# EAGLE design SparkX_smol_Display (EAGLE 9.6.2)
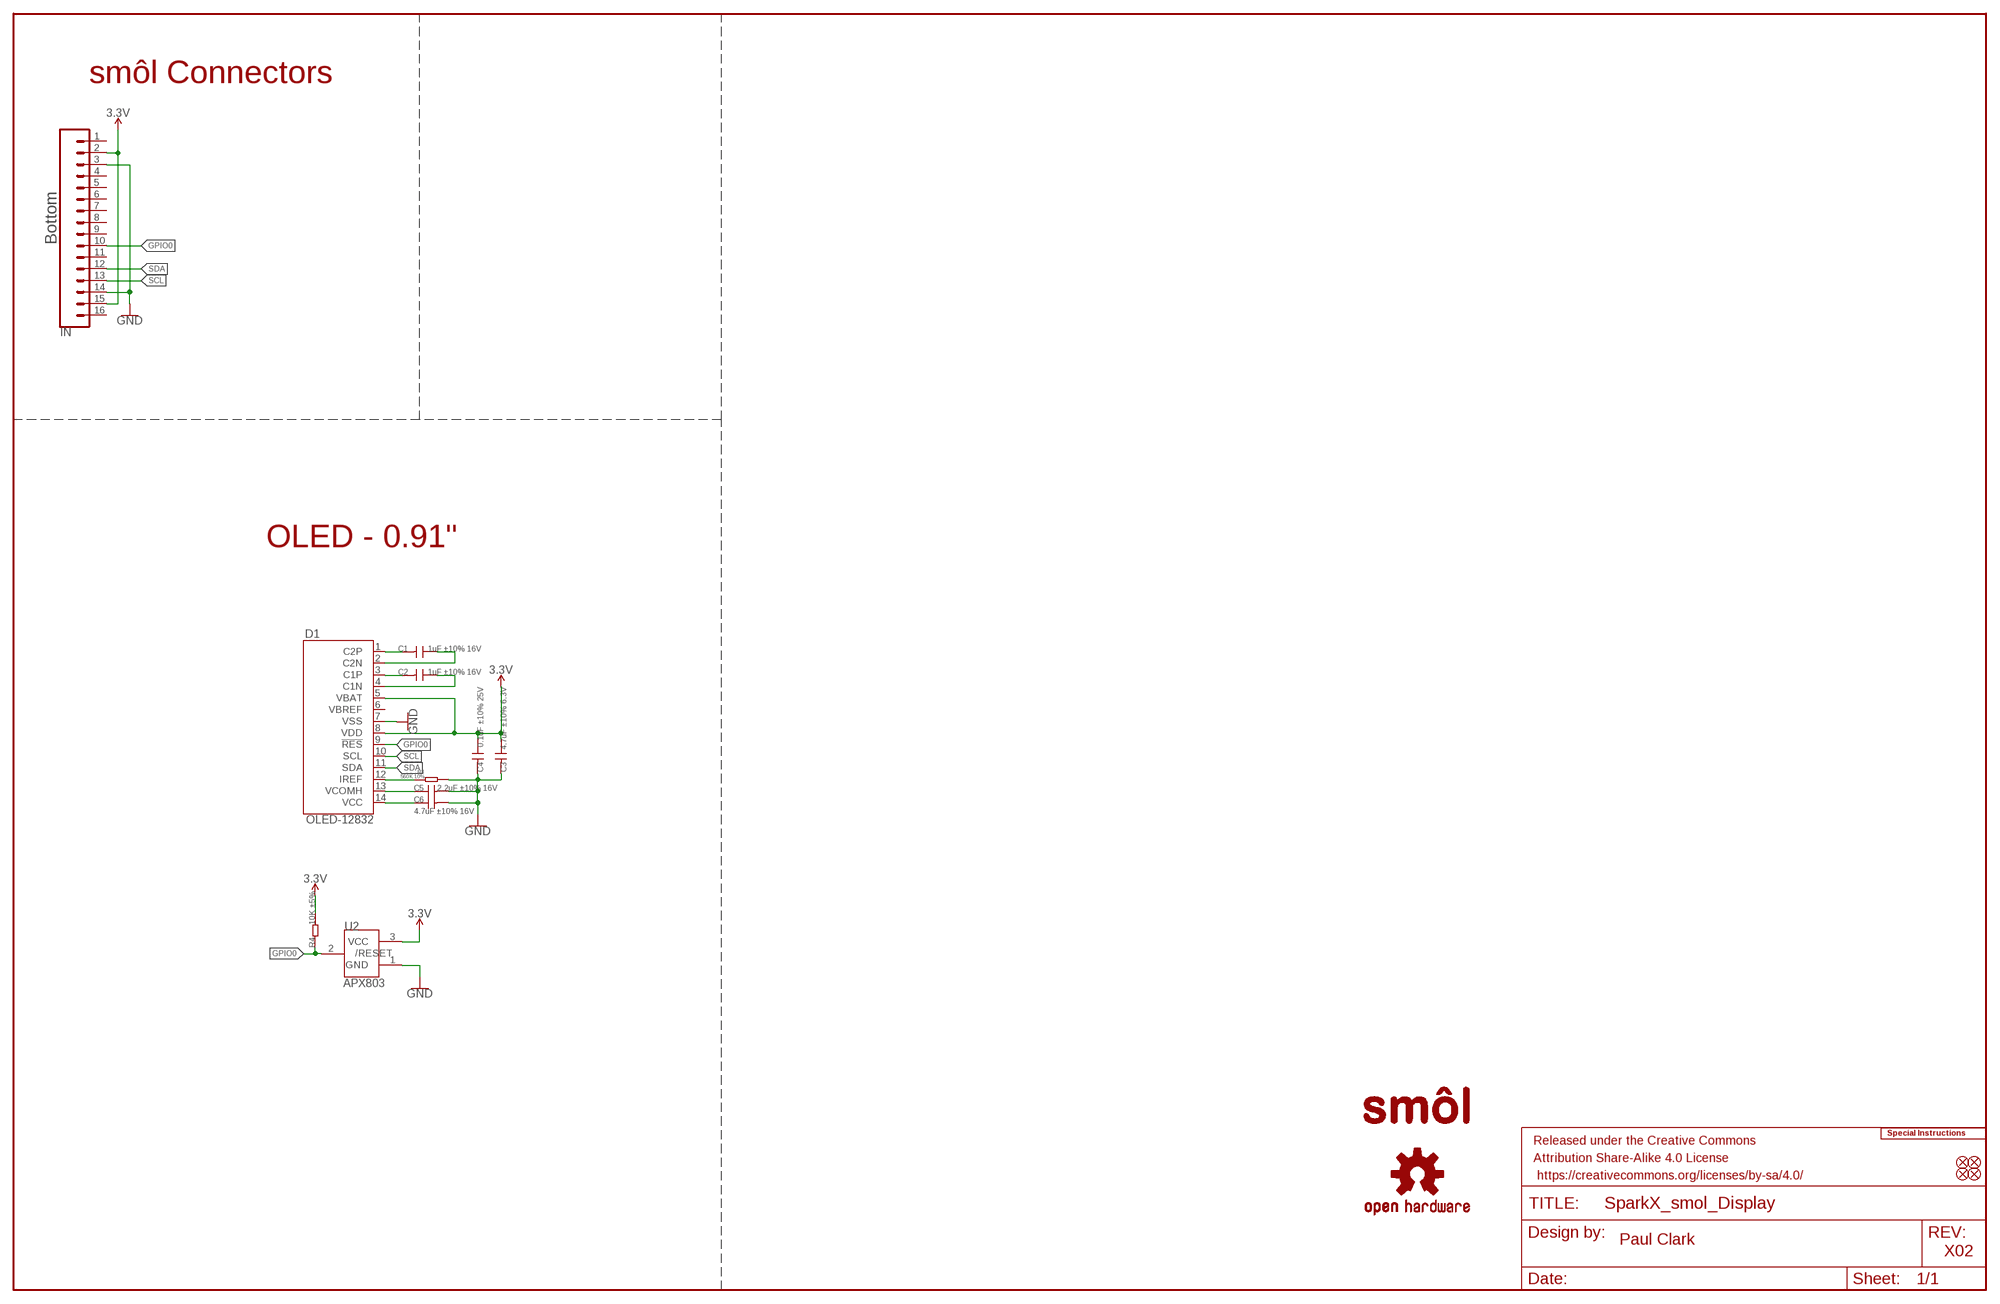
[diagram p0: schematic, sheet 1]

## Parts
C1  1uF ±10% 16V  C-0603  [0603]
C2  1uF ±10% 16V  C-0603  [0603]
C3  4.7uF ±10% 6.3V  C-0603  [0603]
C4  0.1uF ±10% 25V  C-0603  [0603]
C5  2.2uF ±10% 16V  C-0603  [0603]
C6  4.7uF ±10% 16V  C-0603  [0603]
D1  OLED-12832  [OLED-12832]
FD1  FIDUCIALUFIDUCIAL  [FIDUCIAL-MICRO]
FD2  FIDUCIALUFIDUCIAL  [FIDUCIAL-MICRO]
FD3  FIDUCIALUFIDUCIAL  [FIDUCIAL-MICRO]
FD4  FIDUCIALUFIDUCIAL  [FIDUCIAL-MICRO]
FRAME1  FRAME-LEDGER  [CREATIVE_COMMONS]
IN  CONN_16FPC_16_0.5MM  [FPC_16_0.5MM]
LOGO1  SPECIAL_INSTRUCTIONS-ORDERING  [ORDERING_INSTRUCTIONS]
LOGO3  OSHW-LOGOMINI  [OSHW-LOGO-MINI]
R3  560K 10%  R-0603  [0603]
R4  10K ±5%  R-0603  [0603]
U2  APX803  [SOT23]
U$14  SMOL_LOGOSMALL  [SMOL_SMALL]

## Nets
3.3V: C3.1 C4.1 D1.5(VBAT) D1.8(VDD) IN.2 IN.15 R4.2 U2.3(VCC)
GND: C3.2 C4.2 C5.2 C6.2 D1.7(VSS) IN.3 IN.14 R3.1 U2.1(GND)
GPIO0: D1.9(!RES!) IN.10 R4.1 U2.2(/RESET)
N$1: C1.2 D1.1(C2P)
N$2: C1.1 D1.2(C2N)
N$3: C2.2 D1.3(C1P)
N$4: C2.1 D1.4(C1N)
N$6: C5.1 D1.13(VCOMH)
N$7: C6.1 D1.14(VCC)
N$9: D1.12(IREF) R3.2
SCL: D1.10(SCL) IN.13
SDA: D1.11(SDA) IN.12
Unconnected: D1.6(VBREF) IN.1 IN.4 IN.5 IN.6 IN.7 IN.8 IN.9 IN.11 IN.16

## Notes on the sheet
- smôl Connectors
- Bottom
- OLED - 0.91"
- Paul Clark
- X02

## Library data of the parts
C1-C6 = Discrete:C*: Ceramic Capacitors
D1 = CustomParts:OLED-12832
FD1-FD4 = SparkFun-Aesthetics:FIDUCIAL: Fiducial Alignment Points Point-of-reference for pick-and-place machines and other optical instruments.
FRAME1 = SparkFun-Aesthetics:FRAME-LEDGER: Schematic Frame - Ledger Standard 11x14 US Ledger frame
IN = SparkFun-Connectors:CONN_16: Multi connection point. Often used as Generic Header-pin footprint for 0.1 inch spaced/style header connections On any of the 0.1 inch spaced packages, you can populate with these: Break Away Headers - Straight <https://www.sparkfun.com/products/116> (PRT-00116) Break Away Male Headers - Right Angle <https://www.sparkfun.com/products/553> (PRT-00553) Female Headers <https://www.sparkfun.com/products/115> (PRT-00115) Break Away Headers - Machine Pin <https://www.sparkfun.com/products/117> (PRT-00117) Break Away Female Headers - Swiss Machine Pin <https://www.sparkfun.com/products/743> (PRT-00743) For SCREWTERMINALS and SPRING TERMINALS visit here: Screw Terimnals on SparkFun.com <https://www.sparkfun.com/search/results?term=Screw+Terminals> (5mm/3.5mm/2.54mm spacing) This device is also useful as a general connection point to wire up your design to another part of your project. Our various solder wires solder well into these plated through hole pads. Hook-Up Wire - Assortment (Stranded, 22 AWG) <https://www.sparkfun.com/products/11375> (PRT-11375) Hook-Up Wire - Assortment (Solid Core, 22 AWG) <https://www.sparkfun.com/products/11367> (PRT-11367) View the entire wire category on our website here <https://www.sparkfun.com/categories/141> Special notes: Molex polarized connector foot print use with SKU : PRT-08231 with associated crimp pins and housings. 1MM SMD Version SKU: PRT-10208 NOTES ON THE VARIANTS LOCK and LOCK_LONGPADS... This footprint was designed to help hold the alignment of a through-hole component (i.e. 6-pin header) while soldering it into place. You may notice that each hole has been shifted either up or down by 0.005 of an inch from it's more standard position (which is a perfectly straight line). This slight alteration caused the pins (the squares in the middle) to touch the edges of the holes. Because they are alternating, it causes a "brace" to hold the component in place. 0.005 has proven to be the perfect amount of "off-center" position when using our standard breakaway headers. Although looks a little odd when you look at the bare footprint, once you have a header in there, the alteration is very hard to notice. Also,if you push a header all the way into place, it is covered up entirely on the bottom side.; PROD_ID: CONN-16066
LOGO1 = SparkFun-Aesthetics:SPECIAL_INSTRUCTIONS: Special Ordering/Production Instructions Alert Symbol for special PCB ordering instructions or unique production process warnings. Ordering Instructions Production Instructions Types of information that should be added to box: Copper weight Soldermask color Silk color PCB thickness Number of layers PCB Standard: 1.6mm FR4 1 oz copper immersion silver plating red soldermask white silkscreen Types of information that should be added to box: Special wash requirements Depaneling instructions Humidification Glue curing Default text settings: 0.07 inch 9% ratio 50% line distance
LOGO3 = SparkFun-Aesthetics:OSHW-LOGO: Open-Source Hardware (OSHW) Logo This logo indicates the piece of hardware it is found on incorporates a OSHW license and/or adheres to the definition of open source hardware found here: http://freedomdefined.org/OSHW
R3 R4 = Discrete:R*
U2 = IC:APX803
U$14 = SparkX:SMOL_LOGO

## Net classes
1 Power: width 0.305 mm
2 3.3V: width 0.508 mm

## Board
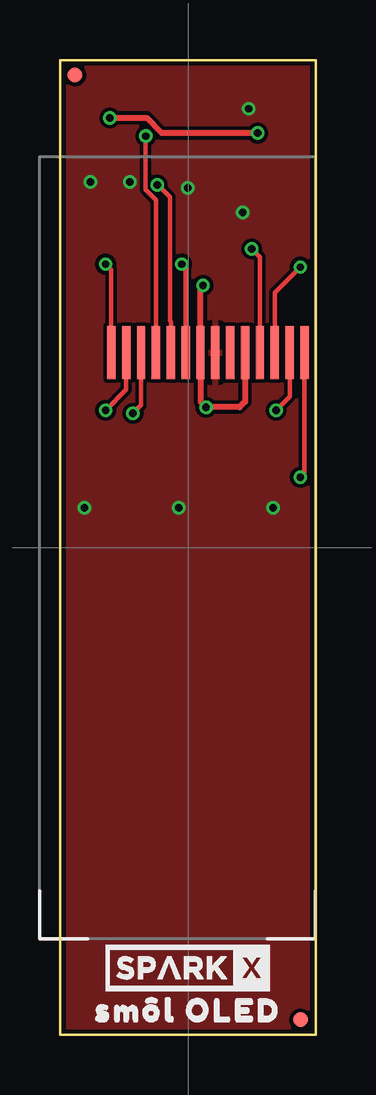
[diagram p1: board, top side]
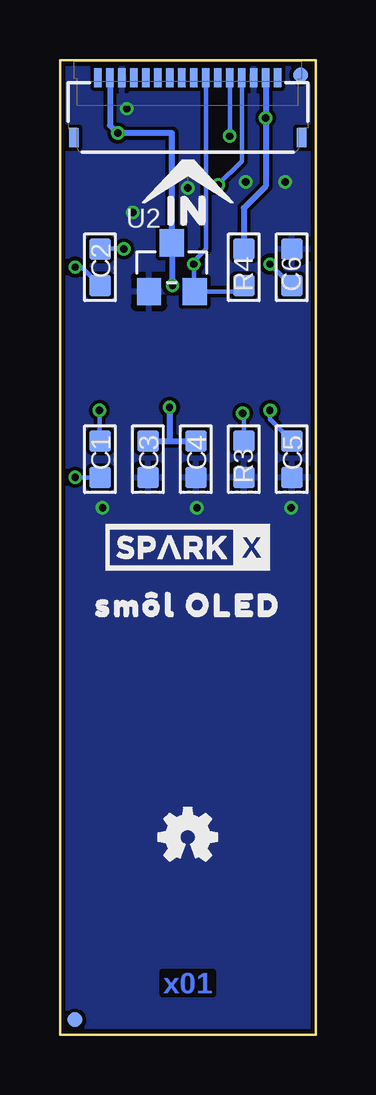
[diagram p2: board, bottom side, seen from below]

Size 10.67 x 40.64 mm. Coordinates in mm from the lower left corner, seen from the top.
Outline: 0,40.64 0,0 10.67,0 10.67,40.64 0,40.64
Copper layers (1*16): Top 0.035mm / dielectric 1.5mm / Bottom 0.035mm
Design rules "SparkFun-2-Layer-Minimum-JLCPCB": minimum track width 5mil, minimum drill 0.3mm, track to track 5mil, track to pad 5mil, pad to pad 5mil, via to via 5mil, smd to smd 5mil, copper to edge 7mil, drill to drill 7mil, minimum pad ring 5mil, minimum via ring 5mil, stop-mask expansion 2.5mil, vias tented up to drill 25mil, thermal gap 10mil

### Footprints (pad centres in the part's own frame; a part is rotated, then mirrored left to right if it is on the bottom)
0603 = smd 0.889 x 0.889: 1 -0.762,0; 2 0.762,0
OLED-12832 = smd 2.2 x 0.35: 1 8.145,-5.305; 2 8.145,-4.685; 3 8.145,-4.065; 4 8.145,-3.445; 5 8.145,-2.825; 6 8.145,-2.205; 7 8.145,-1.585; 8 8.145,-0.965; 9 8.145,-0.345; 10 8.145,0.275; 11 8.145,0.895; 12 8.145,1.515; 13 8.145,2.135; 14 8.145,2.755
FIDUCIAL-MICRO = smd 0.635 x 0.635: 1 0,0
FPC_16_0.5MM = smd 0.3 x 0.8: 1 -3.75,1.35; 2 -3.25,1.35; 3 -2.75,1.35; 4 -2.25,1.35; 5 -1.75,1.35; 6 -1.25,1.35; 7 -0.75,1.35; 8 -0.25,1.35; 9 0.25,1.35; 10 0.75,1.35; 11 1.25,1.35; 12 1.75,1.35; 13 2.25,1.35; 14 2.75,1.35; 15 3.25,1.35; 16 3.75,1.35 | smd 0.4 x 0.8: MP1 -4.75,-1.15; MP2 4.75,-1.15
SOT23 = smd 1.016 x 1.143: 1 -0.95,-1.016; 2 0.95,-1.016; 3 0,1.016

### Placement (x,y rotation side)
C1  9,24 270 bottom
C2  9,32 270 bottom
C3  7,24 270 bottom
C4  5,24 270 bottom
C5  1,24 270 bottom
C6  1,32 90 bottom
D1  4.9,20.3 90 top
FD1  0.64,40.01 0 top
FD2  0.64,40.01 0 bottom
FD3  10.03,0.64 0 top
FD4  10.03,0.64 0 bottom
FRAME1  45.72,-10.16 0 top  (outside the outline)
IN  5.33,38.54 0 bottom
LOGO1  19.05,50.8 0 top  (outside the outline)
LOGO3  5.33,8.26 0 bottom
R3  3,24 90 bottom
R4  3,32 90 bottom
U2  6,32 0 bottom
U$1  [SM�L_OLED0]  5.33,17.91 0 bottom
U$3  SPARKX-LOGO3  [SPARKX-SMALL]  5.33,2.79 0 top
U$4  [SM�L_OLED0]  5.33,1.02 0 top
U$12  [IN0]  5.33,34.35 0 bottom
U$14  5.33,35.81 0 bottom
U$20  SPARKX-LOGO3  [SPARKX-SMALL]  5.33,20.32 0 bottom

### Tracks (layer width: path | path; a pad name or v marks a point on that pad's centre or on a via)
3.3V  (via drill 0.3)
  Top 0.254: v5.97,31.24 5.87,31.14 D1.8 5.87,26.39 v6.1,26.16 7.49,26.16 7.72,26.39 D1.5 | v8.26,37.59 4.24,37.59 3.61,38.23 v2.08,38.23
  Bottom 0.254: IN.15 v2.08,38.23 2.08,35.38 3,34.47 R4.2 | v5.97,31.24 6,31.27 U2.3 6,37.59 v8.26,37.59 8.58,37.92 IN.2 | C3.1 6.1,24.76 | 6.1,24.76 C4.1 | v6.1,26.16 6.1,24.76
GND  (via drill 0.3)
  other vias: 1.02,21.97 4.95,21.97 8.89,21.97 7.62,34.29 2.92,35.56 1.27,35.56 5.33,35.31 7.87,38.61
  pour Top (isolate 0.152, rank 3): 0,40.64 10.67,40.64 10.67,0 0,0
  pour Bottom (isolate 0.152, rank 2): 0,40.64 10.67,40.64 10.67,0 0,0
GPIO0  (via drill 0.3)
  Top 0.178: D1.9 5.25,31.97 v5.08,32.13
  Bottom 0.178: R4.1 3.25,30.98 U2.2 5.08,31.01 v5.08,32.13 5.08,32.26 4.58,32.75 IN.10
N$1  (via drill 0.3)
  Top 0.178: D1.1 10.21,23.41 v10.03,23.24
  Bottom 0.178: v10.03,23.24 C1.2
N$2  (via drill 0.3)
  Top 0.178: D1.2 9.59,26.6 v9.02,26.04
  Bottom 0.178: v9.02,26.04 9.02,24.78 C1.1
N$3  (via drill 0.3)
  Top 0.178: D1.3 8.96,30.94 v10.03,32
  Bottom 0.178: v10.03,32 9.77,32 C2.2
N$4  (via drill 0.3)
  Top 0.178: D1.4 8.35,32.42 v8,32.77
  Bottom 0.178: v8,32.77 C2.1
N$6  (via drill 0.3)
  Top 0.178: D1.13 2.77,26.89 v1.91,26.04
  Bottom 0.178: v1.91,26.04 1.91,25.67 C5.1
N$7  (via drill 0.3)
  Top 0.178: D1.14 2.15,31.89 v1.91,32.13
  Bottom 0.178: v1.91,32.13 1.01,31.24 C6.1
N$9  (via drill 0.3)
  Top 0.178: D1.12 3.38,26.25 v3.05,25.91
  Bottom 0.178: v3.05,25.91 3,25.86 R3.2
SCL  (via drill 0.3)
  Top 0.178: D1.10 4.62,29.73 4.58,29.77 4.58,34.91 v4.06,35.43
  Bottom 0.178: v4.06,35.43 3.08,36.41 IN.13
SDA  (via drill 0.3)
  Top 0.178: D1.11 4,34.79 3.57,35.23 3.57,35.64 3.58,35.65 v3.58,37.47
  Bottom 0.178: v3.58,37.47 IN.12

### Text on the board
Bottom: x01
Measures: Dimensions in Inches
tDocu: 2-Layer Board / 0.8mm Thickness | Paul Clark